# Altium project URC_eZ-FET_Lite.PrjPcb
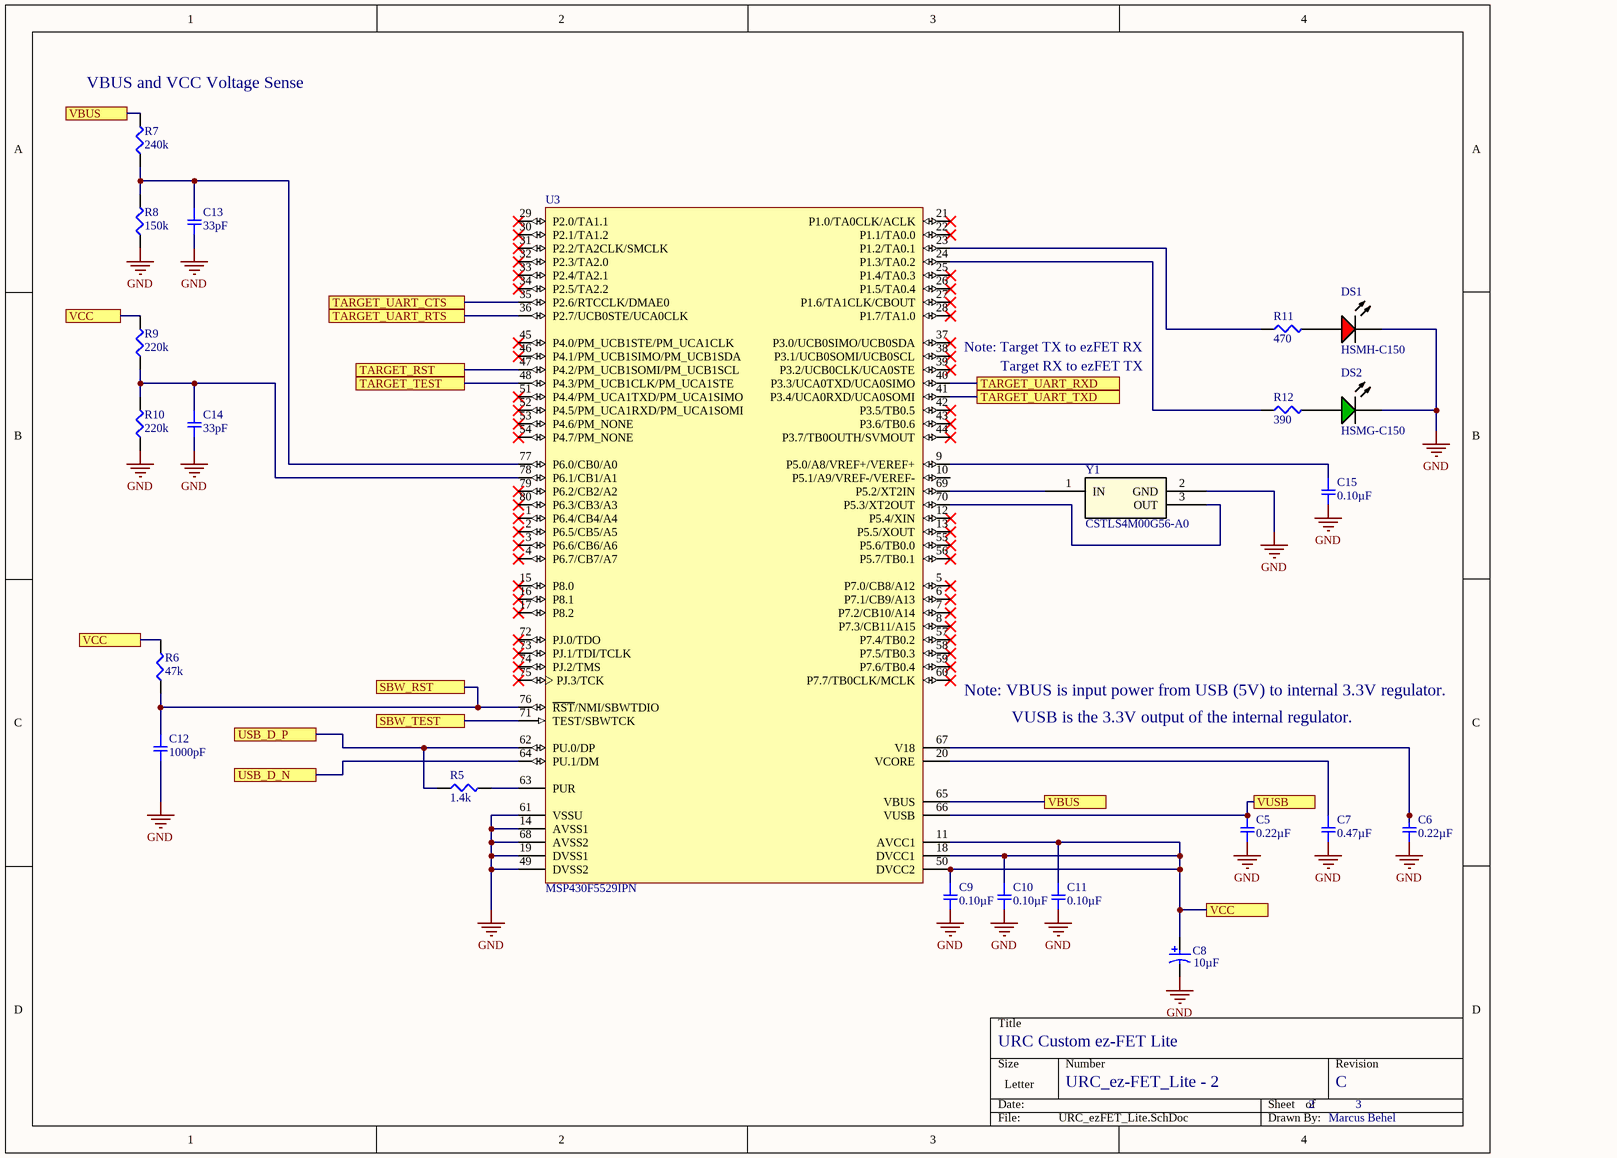
[diagram p0: URC_ezFET_Lite.SchDoc]
3 sheets, 36 parts. Net scope: global (net labels, ports and power ports of the same name join across sheets).
Board file: URC_ezFET_Lite.PcbDoc
Sheets:
  URC_ezFET_Lite.SchDoc
  URC_ezFET_Lite-USB.SchDoc
  URC_eZFET_Lite-Headers.SchDoc

## Sheet URC_ezFET_Lite.SchDoc: URC Custom ez-FET Lite
size Letter; DrawnBy: Marcus Behel; DocumentNumber: URC_ez-FET_Lite - 2; Revision: C; SheetNumber: 2; SheetTotal: 3

### Parts
C5  0.22µF  [SMD-1206C]
C6  0.22µF  [SMD-1206C]
C7  0.47µF  [SMD-1206C]
C8  Capacitance: 10µF  [KEMT-A-3216-18-2_M]  (hidden comment: T491A106K010AT)
C9  0.10µF  [SMD-1206C]
C10  0.10µF  [SMD-1206C]
C11  0.10µF  [SMD-1206C]
C12  1000pF  [SMD-1206C]
C13  33pF  [SMD-1206C]
C14  33pF  [SMD-1206C]
C15  0.10µF  [SMD-1206C]
DS1  HSMH-C150  [AVAG-HSMX-C150_V]
DS2  HSMG-C150  [AVAG-HSMX-C150_V]
R5  1.4k  [SMD-0805-RES]
R6  47k  [SMD-1206-RES]
R7  240k  [SMD-1206-RES]
R8  150k  [SMD-1206-RES]
R9  220k  [SMD-1206-RES]
R10  220k  [SMD-1206-RES]
R11  470  [SMD-1206-RES]
R12  390  [SMD-1206-RES]
U3  MSP430F5529IPN  [PN0080A_L]
Y1  CSTLS4M00G56-A0  [CSTLS_G]

### Ports
SBW_RST, SBW_TEST, TARGET_RST, TARGET_TEST, TARGET_UART_CTS, TARGET_UART_RTS, TARGET_UART_RXD, TARGET_UART_TXD, USB_D_N, USB_D_P, VBUS, VCC, VUSB

### Nets
GND: C5.2 C6.2 C7.2 C8.2 C9.2 C10.2 C11.2 C12.2 C13.2 C14.2 C15.2 DS1.2(K) DS2.2(K) R8.1 R10.1 U3.14(AVSS1) U3.19(DVSS1) U3.49(DVSS2) U3.61(VSSU) U3.68(AVSS2) Y1.2(GND)
SBW_RST: C12.1 R6.1 U3.76(~{RST}/NMI/SBWTDIO) ; port SBW_RST
SBW_TEST: U3.71(TEST/SBWTCK) ; port SBW_TEST
TARGET_RST: U3.47(P4.2/PM_UCB1SOMI/PM_UCB1SCL) ; port TARGET_RST
TARGET_TEST: U3.48(P4.3/PM_UCB1CLK/PM_UCA1STE) ; port TARGET_TEST
TARGET_UART_CTS: U3.35(P2.6/RTCCLK/DMAE0) ; port TARGET_UART_CTS
TARGET_UART_RTS: U3.36(P2.7/UCB0STE/UCA0CLK) ; port TARGET_UART_RTS
TARGET_UART_RXD: U3.40(P3.3/UCA0TXD/UCA0SIMO) ; port TARGET_UART_RXD
TARGET_UART_TXD: U3.41(P3.4/UCA0RXD/UCA0SOMI) ; port TARGET_UART_TXD
USB_D_N: U3.64(PU.1/DM) ; port USB_D_N
USB_D_P: R5.1 U3.62(PU.0/DP) ; port USB_D_P
VBUS: R7.2 U3.65(VBUS) ; port VBUS
VCC: C8.1 C9.1 C10.1 C11.1 R6.2 R9.2 U3.11(AVCC1) U3.18(DVCC1) U3.50(DVCC2) ; port VCC
VUSB: C5.1 U3.66(VUSB) ; port VUSB
NetC6_1: C6.1 U3.67(V18)
NetC7_1: C7.1 U3.20(VCORE)
NetC13_1: C13.1 R7.1 R8.2 U3.77(P6.0/CB0/A0)
NetC14_1: C14.1 R9.1 R10.2 U3.78(P6.1/CB1/A1)
NetC15_1: C15.1 U3.9(P5.0/A8/VREF+/VEREF+)
NetDS1_1: DS1.1(A) R11.2
NetDS2_1: DS2.1(A) R12.2
NetR5_2: R5.2 U3.63(PUR)
NetR11_1: R11.1 U3.23(P1.2/TA0.1)
NetR12_1: R12.1 U3.24(P1.3/TA0.2)
NetU3_69: U3.69(P5.2/XT2IN) Y1.1(IN)
NetU3_70: U3.70(P5.3/XT2OUT) Y1.3(OUT)

Not connected (* = marked no-connect by the designer): U3 1(P6.4/CB4/A4)* 2(P6.5/CB5/A5)* 3(P6.6/CB6/A6)* 4(P6.7/CB7/A7)* 5(P7.0/CB8/A12)* 6(P7.1/CB9/A13)* 7(P7.2/CB10/A14)* 8(P7.3/CB11/A15)* 10(P5.1/A9/VREF-/VEREF-) 12(P5.4/XIN)* 13(P5.5/XOUT)* 15(P8.0)* 16(P8.1)* 17(P8.2)* 21(P1.0/TA0CLK/ACLK)* 22(P1.1/TA0.0)* 25(P1.4/TA0.3)* 26(P1.5/TA0.4)* 27(P1.6/TA1CLK/CBOUT)* 28(P1.7/TA1.0)* 29(P2.0/TA1.1)* 30(P2.1/TA1.2)* 31(P2.2/TA2CLK/SMCLK)* 32(P2.3/TA2.0)* 33(P2.4/TA2.1)* 34(P2.5/TA2.2)* 37(P3.0/UCB0SIMO/UCB0SDA)* 38(P3.1/UCB0SOMI/UCB0SCL)* 39(P3.2/UCB0CLK/UCA0STE)* 42(P3.5/TB0.5)* 43(P3.6/TB0.6)* 44(P3.7/TB0OUTH/SVMOUT)* 45(P4.0/PM_UCB1STE/PM_UCA1CLK)* 46(P4.1/PM_UCB1SIMO/PM_UCB1SDA)* 51(P4.4/PM_UCA1TXD/PM_UCA1SIMO)* 52(P4.5/PM_UCA1RXD/PM_UCA1SOMI)* 53(P4.6/PM_NONE)* 54(P4.7/PM_NONE)* 55(P5.6/TB0.0)* 56(P5.7/TB0.1)* 57(P7.4/TB0.2)* 58(P7.5/TB0.3)* 59(P7.6/TB0.4)* 60(P7.7/TB0CLK/MCLK)* 72(PJ.0/TDO)* 73(PJ.1/TDI/TCLK)* 74(PJ.2/TMS)* 75(PJ.3/TCK)* 79(P6.2/CB2/A2)* 80(P6.3/CB3/A3)*

### Notes on the sheet
- (near R7) VBUS and VCC Voltage Sense
- (near U3) Note: Target TX to ezFET RX
- Target RX to ezFET TX
- (near U3) Note: VBUS is input power from USB (5V) to internal 3.3V regulator.
- VUSB is the 3.3V output of the internal regulator.

### Library data of the parts
C5 C6 = GCM31MR71H224KA37L: CAP CER 0.22UF 50V X7R 1206; Manufacturer: Murata Electronics North America; Factory Stock: 0; Unit Price (USD): 0.34; Minimum Quantity: 1; Tolerance: ±10%; Datasheets: http://www.murata.com/~/media/webrenewal/support/library/catalog/products/capacitor/mlcc/c03e.ashx; Image: //media.digikey.com/Renders/Murata%20Renders/GR331BD72E473KW01L.jpg; Digi-Key Part Number: 490-8059-1-ND; Part Number: GCM31MR71H224KA37L; Quantity Available: 6941; @ qty: 0; Packaging: Cut Tape (CT); Series: GCM; Part Status: Active; Value: 0.22µF; Voltage: 50V; Temperature Coefficient: X7R; Operating Temperature: -55°C ~ 125°C; Features: -; Ratings: AEC-Q200; Applications: Automotive; Mounting Type: Surface Mount, MLCC; Package / Case: 1206 (3216 Metric); Size / Dimension: 0.126" L x 0.063" W (3.20mm x 1.60mm); Height - Seated (Max): -; Thickness (Max): 0.049" (1.25mm); Lead Spacing: -; Lead Style: -
C7 = GCM31MR71H474KA37L: CAP CER 0.47UF 50V X7R 1206; Manufacturer: Murata Electronics North America; Factory Stock: 0; Unit Price (USD): 0.53; Minimum Quantity: 1; Tolerance: ±10%; Datasheets: http://www.murata.com/~/media/webrenewal/support/library/catalog/products/capacitor/mlcc/c03e.ashx; Image: //media.digikey.com/Renders/Murata%20Renders/GR331BD72E473KW01L.jpg; Digi-Key Part Number: 490-8061-1-ND; Part Number: GCM31MR71H474KA37L; Quantity Available: 11849; @ qty: 0; Packaging: Cut Tape (CT); Series: GCM; Part Status: Active; Value: 0.47µF; Voltage: 50V; Temperature Coefficient: X7R; Operating Temperature: -55°C ~ 125°C; Features: -; Ratings: AEC-Q200; Applications: Automotive; Mounting Type: Surface Mount, MLCC; Package / Case: 1206 (3216 Metric); Size / Dimension: 0.126" L x 0.063" W (3.20mm x 1.60mm); Height - Seated (Max): -; Thickness (Max): 0.049" (1.25mm); Lead Spacing: -; Lead Style: -
C8 = CMP-2000-05172-1: Capacitor, Tantalum, 10 uF, +/- 10%, 10 V, -55 to 125 degC, 2-Pin SMD (1206), RoHS, Tape and Reel; Manufacturer Size Code: A; Manufacturer: Kemet; Type: Molded; Online Catalog: T491Series; Other Names: 399-3684-2; Voltage - Rated: 10V; Lifetime @ Temp.: 2000Hrs@85degC; Product Training Modules: CapacitorBasics-TypicalUsesforCapacitorsDeratingGuidelinesforSurfaceMountTantalumCapacitors; ESR (Equivalent Series Resistance): 3.8Ohm; Catalog Drawings: T49x,T5xxSeries_A-side1T49x,T5xxSeries_A,B-side2T49x,T5xxSeries_A,SBottom; Family: TantalumCapacitors; Manufacturer URL: http://www.kemet.com/; Datasheet URL: http://www.farnell.com/datasheets/1824869.pdf; Package Reference: 1206; Packaging: Tape&Reel(TR); Series: T491; Operating Temperature: -55degC~125degC; Mounting Type: SurfaceMount; Height - Seated (Max): 0.071"(1.80mm); Package / Case: 1206(3216Metric); Package Description: 2-Pin Surface Mount Device, Body 3.2 x 1.6 mm; Features: GeneralPurpose; Tolerance: ±10%; Lead Spacing: -; Size / Dimension: 0.126"Lx0.063"W(3.20mmx1.60mm); Standard Package: 2,000; Datasheet Version: Apr-14; Category: Capacitors
C9-C11 = GCM319R71H104KA37D: CAP CER 0.1UF 50V X7R 1206; Manufacturer: Murata Electronics North America; Factory Stock: 0; Unit Price (USD): 0.21; Minimum Quantity: 1; Tolerance: ±10%; Datasheets: http://www.murata.com/~/media/webrenewal/support/library/catalog/products/capacitor/mlcc/c03e.ashx; Image: //media.digikey.com/Renders/Murata%20Renders/GR331BD72E473KW01L.jpg; Digi-Key Part Number: 490-11166-1-ND; Part Number: GCM319R71H104KA37D; Quantity Available: 5066; @ qty: 0; Packaging: Cut Tape (CT); Series: GCM; Part Status: Active; Value: 0.10µF; Voltage: 50V; Temperature Coefficient: X7R; Operating Temperature: -55°C ~ 125°C; Features: -; Ratings: AEC-Q200; Applications: Automotive; Mounting Type: Surface Mount, MLCC; Package / Case: 1206 (3216 Metric); Size / Dimension: 0.126" L x 0.063" W (3.20mm x 1.60mm); Height - Seated (Max): -; Thickness (Max): 0.037" (0.95mm); Lead Spacing: -; Lead Style: -
C12 = GRM319R71H102KA01D: CAP CER 1000PF 50V X7R 1206; Manufacturer: Murata Electronics North America; Factory Stock: 0; Unit Price (USD): 0.19; Minimum Quantity: 1; Tolerance: ±10%; Datasheets: http://www.murata.com/~/media/webrenewal/support/library/catalog/products/capacitor/mlcc/c02e.pdf; Image: //media.digikey.com/Renders/Murata%20Renders/GR331BD72E473KW01L.jpg; Digi-Key Part Number: 490-11610-1-ND; Part Number: GRM319R71H102KA01D; Quantity Available: 4837; @ qty: 0; Packaging: Cut Tape (CT); Series: GRM; Part Status: Active; Value: 1000pF; Voltage: 50V; Temperature Coefficient: X7R; Operating Temperature: -55°C ~ 125°C; Features: -; Ratings: -; Applications: General Purpose; Mounting Type: Surface Mount, MLCC; Package / Case: 1206 (3216 Metric); Size / Dimension: 0.126" L x 0.063" W (3.20mm x 1.60mm); Height - Seated (Max): -; Thickness (Max): 0.037" (0.95mm); Lead Spacing: -; Lead Style: -
C13 C14 = GCM31A7U2J330JX01D: CAP CER 33PF 630V U2J 1206; Manufacturer: Murata Electronics North America; Factory Stock: 0; Unit Price (USD): 0.52; Minimum Quantity: 1; Tolerance: ±5%; Datasheets: http://www.murata.com/~/media/webrenewal/support/library/catalog/products/capacitor/mlcc/c03e.ashx; Image: //media.digikey.com/Renders/Murata%20Renders/GR331BD72E473KW01L.jpg; Digi-Key Part Number: 490-5040-1-ND; Part Number: GCM31A7U2J330JX01D; Quantity Available: 10466; @ qty: 0; Packaging: Cut Tape (CT); Series: GCM; Part Status: Active; Value: 33pF; Voltage: 630V; Temperature Coefficient: U2J; Operating Temperature: -55°C ~ 125°C; Features: -; Ratings: AEC-Q200; Applications: Automotive; Mounting Type: Surface Mount, MLCC; Package / Case: 1206 (3216 Metric); Size / Dimension: 0.126" L x 0.063" W (3.20mm x 1.60mm); Height - Seated (Max): -; Thickness (Max): 0.039" (1.00mm); Lead Spacing: -; Lead Style: -
C15 = GCJ31CR72E104KXJ3L: CAP CER 0.1UF 250V X7R 1206; Manufacturer: Murata Electronics North America; Factory Stock: 0; Unit Price (USD): 0.36; Minimum Quantity: 1; Tolerance: ±10%; Datasheets: http://www.murata.com/~/media/webrenewal/support/library/catalog/products/capacitor/mlcc/c03e.ashx; Image: //media.digikey.com/Renders/Murata%20Renders/GR331BD72E473KW01L.jpg; Digi-Key Part Number: 490-12647-1-ND; Part Number: GCJ31CR72E104KXJ3L; Quantity Available: 3645; @ qty: 0; Packaging: Cut Tape (CT); Series: GCJ; Part Status: Active; Value: 0.10µF; Voltage: 250V; Temperature Coefficient: X7R; Operating Temperature: -55°C ~ 125°C; Features: Soft Termination; Ratings: AEC-Q200; Applications: Automotive, Boardflex Sensitive; Mounting Type: Surface Mount, MLCC; Package / Case: 1206 (3216 Metric); Size / Dimension: 0.126" L x 0.063" W (3.20mm x 1.60mm); Height - Seated (Max): -; Thickness (Max): 0.071" (1.80mm); Lead Spacing: -; Lead Style: -
DS1 = CMP-2000-06426-1: LED Uni-Color Red, 65 mW, 25 mA, -40 to 85 degC, 2-Pin SMD, RoHS, Tape and Reel; Manufacturer: Avago; Product Height (mm): 1.1mm; Power Dissipation: 78W; Product Length (mm): 3.2mm; Forward Voltage: 2.6V; Luminous Intensity: 17mcd; DELETED: Compliant; Shape Type: Rectangular; Peak Wavelength: 660nm; Main Category: ChipLED; Dominant Wave Length: 639nm; Rad Hardened: No; Lens Type: ColorlessDiffused; Product Depth (mm): 1.6mm; Reverse Voltage: 5V; Forward Current: 25mA; Chip Material: GaAlAs; Test Current (It): 20mA; Viewing Angle: 170deg; Number of  Elements: 1; Type: Uni-Color; Package Reference: HSMX-C150; Package Description: 2-Pin Surface Mount Device, Body 3.2 x 1.6 mm; Operating Temp Range: -40Cto85C; Mounting: SurfaceMount; Emitting Color: Red; Pin Count: 2; Operating Temperature Classification: Industrial; Datasheet URL: http://media.digikey.com/pdf/Data%20Sheets/Avago%20PDFs/HSMz-Czzz.pdf; Package Type: ChipLed; Mounting Technology: SurfaceMount; High Brightness: No; Lens Dimensions: 2x1.6x0.6mm; Manufacturer URL: http://www.avagotech.com/; Lum Intensity: 17mcd; Datasheet Version: 03/2012; Packaging: TapeandReel
DS2 = CMP-2000-05061-1: Chip LED, Green, 65 mW, 25 mA, -40 to 85 degC, 2-Pin SMD, RoHS, Tape and Reel; Manufacturer: Avago; Forward Voltage VF Max: 2.6V; Forward Current If Max: 20mA; Bulb Size: 1.6mmx2mm; PIV Max: 5V; Dominant Wavelength: 572nm; External Length / Height: 3.2mm; SVHC: NoSVHC(16-Jun-2014); Viewing Angle: 170deg; Peak Wavelength: 570nm; External Width: 1.6mm; No. of Pins: 2; Luminous Intensity Typ: 15mcd; Light Output Orientation: TopEmitting; LED Type: Standard; Luminous Intensity @ If Min: 4.5mcd; Voltage Vf Min: 2.2V; Lens Shape: Rectangular; External Depth: 1.1mm; Material: GaP; Opto Mounting Orientation: Top; Package Reference: HSMX-C150; Mounting Type: SMD; Datasheet Version: Mar-12; Storage Temperature Max: 85degC; Forward Current If: 20mA; Operating Temperature Min: -30degC; Operating Temperature Max: 85degC; Wavelength Typ: 572nm; Datasheet URL: https://datasheet.ciiva.com/11774/0900766b804a6539-11774272.pdf; Luminous Intensity: 15mcd; Manufacturer URL: http://www.avagotech.com/; Storage Temperature Min: -40degC; Package Description: 2-Pin Surface Mount Device, Body 3.2 x 1.6 mm; MSL: MSL2A-4weeks; LED Colour: Green; Operating Temperature Range: -30degCto+85degC; LED Mounting: SMD; Voltage Vf Typ: 2.2V; Opto Case Style: SMD; Packaging: CutTape; Forward Voltage: 2.2V; Reverse Protection Voltage: 5V
R5 = ERJ-6ENF1401V: RES SMD 1.4K OHM 1% 1/8W 0805; Manufacturer: Panasonic Electronic Components; Factory Stock: 0; Unit Price (USD): 0.00729; @ qty: 1500; Minimum Quantity: 1; Power (Watts): 0.125W, 1/8W; Temperature Coefficient: ±100ppm/°C; Part Number: ERJ-6ENF1401V; Datasheets: http://industrial.panasonic.com/www-cgi/jvcr13pz.cgi?E+PZ+3+AOA0002+ERJ6ENF1401V+7+WW; Image: //media.digikey.com/Renders/Panasonic%20Renders/ERJ-0805%20Pkg.jpg; Digi-Key Part Number: P1.40KCCT-ND; Quantity Available: 52856; Packaging: Cut Tape (CT); Series: ERJ; Part Status: Active; Value: 1.4k; Tolerance: ±1%; Composition: Thick Film; Features: Automotive AEC-Q200; Operating Temperature: -55°C ~ 155°C; Package / Case: 0805 (2012 Metric); Supplier Device Package: 0805; Size / Dimension: 0.079" L x 0.049" W (2.00mm x 1.25mm); Height - Seated (Max): 0.028" (0.70mm); Number of Terminations: 2; Failure Rate: -
R6 = ERJ-P08J473V: RES SMD 47K OHM 5% 2/3W 1206; Manufacturer: Panasonic Electronic Components; Factory Stock: 0; Unit Price (USD): 0.02178; @ qty: 1500; Minimum Quantity: 1; Power (Watts): 0.667W, 2/3W; Temperature Coefficient: ±200ppm/°C; Part Number: ERJ-P08J473V; Datasheets: https://industrial.panasonic.com/cdbs/www-data/pdf/RDA0000/AOA0000C243.pdf; Image: //media.digikey.com/Renders/Panasonic%20Renders/ERJ-1206%20Pkg.jpg; Digi-Key Part Number: P47KALCT-ND; Quantity Available: 29484; Packaging: Cut Tape (CT); Series: ERJ; Part Status: Active; Value: 47k; Tolerance: ±5%; Composition: Thick Film; Features: Automotive AEC-Q200, Pulse Withstanding; Operating Temperature: -55°C ~ 155°C; Package / Case: 1206 (3216 Metric); Supplier Device Package: 1206; Size / Dimension: 0.126" L x 0.063" W (3.20mm x 1.60mm); Height - Seated (Max): 0.028" (0.70mm); Number of Terminations: 2; Failure Rate: -
R7 = ERJ-P08J244V: RES SMD 240K OHM 5% 2/3W 1206; Manufacturer: Panasonic Electronic Components; Factory Stock: 0; Unit Price (USD): 0.02178; @ qty: 1500; Minimum Quantity: 1; Power (Watts): 0.667W, 2/3W; Temperature Coefficient: ±200ppm/°C; Part Number: ERJ-P08J244V; Datasheets: https://industrial.panasonic.com/cdbs/www-data/pdf/RDA0000/AOA0000C243.pdf; Image: //media.digikey.com/Renders/Panasonic%20Renders/ERJ-1206%20Pkg.jpg; Digi-Key Part Number: P240KALCT-ND; Quantity Available: 21188; Packaging: Cut Tape (CT); Series: ERJ; Part Status: Active; Value: 240k; Tolerance: ±5%; Composition: Thick Film; Features: Automotive AEC-Q200, Pulse Withstanding; Operating Temperature: -55°C ~ 155°C; Package / Case: 1206 (3216 Metric); Supplier Device Package: 1206; Size / Dimension: 0.126" L x 0.063" W (3.20mm x 1.60mm); Height - Seated (Max): 0.028" (0.70mm); Number of Terminations: 2; Failure Rate: -
R8 = ERJ-P08J154V: RES SMD 150K OHM 5% 2/3W 1206; Manufacturer: Panasonic Electronic Components; Factory Stock: 0; Unit Price (USD): 0.02178; @ qty: 1500; Minimum Quantity: 1; Power (Watts): 0.667W, 2/3W; Temperature Coefficient: ±200ppm/°C; Part Number: ERJ-P08J154V; Datasheets: https://industrial.panasonic.com/cdbs/www-data/pdf/RDA0000/AOA0000C243.pdf; Image: //media.digikey.com/Renders/Panasonic%20Renders/ERJ-1206%20Pkg.jpg; Digi-Key Part Number: P150KALCT-ND; Quantity Available: 30000; Packaging: Cut Tape (CT); Series: ERJ; Part Status: Active; Value: 150k; Tolerance: ±5%; Composition: Thick Film; Features: Automotive AEC-Q200, Pulse Withstanding; Operating Temperature: -55°C ~ 155°C; Package / Case: 1206 (3216 Metric); Supplier Device Package: 1206; Size / Dimension: 0.126" L x 0.063" W (3.20mm x 1.60mm); Height - Seated (Max): 0.028" (0.70mm); Number of Terminations: 2; Failure Rate: -
R9 R10 = ERJ-P08J224V: RES SMD 220K OHM 5% 2/3W 1206; Manufacturer: Panasonic Electronic Components; Factory Stock: 0; Unit Price (USD): 0.02178; @ qty: 1500; Minimum Quantity: 1; Power (Watts): 0.667W, 2/3W; Temperature Coefficient: ±200ppm/°C; Part Number: ERJ-P08J224V; Datasheets: https://industrial.panasonic.com/cdbs/www-data/pdf/RDA0000/AOA0000C243.pdf; Image: //media.digikey.com/Renders/Panasonic%20Renders/ERJ-1206%20Pkg.jpg; Digi-Key Part Number: P220KALCT-ND; Quantity Available: 11189; Packaging: Cut Tape (CT); Series: ERJ; Part Status: Active; Value: 220k; Tolerance: ±5%; Composition: Thick Film; Features: Automotive AEC-Q200, Pulse Withstanding; Operating Temperature: -55°C ~ 155°C; Package / Case: 1206 (3216 Metric); Supplier Device Package: 1206; Size / Dimension: 0.126" L x 0.063" W (3.20mm x 1.60mm); Height - Seated (Max): 0.028" (0.70mm); Number of Terminations: 2; Failure Rate: -
R11 = ERJ-8ENF4700V: RES SMD 470 OHM 1% 1/4W 1206; Manufacturer: Panasonic Electronic Components; Factory Stock: 0; Unit Price (USD): 0.00933; @ qty: 1500; Minimum Quantity: 1; Power (Watts): 0.25W, 1/4W; Temperature Coefficient: ±100ppm/°C; Part Number: ERJ-8ENF4700V; Datasheets: http://industrial.panasonic.com/www-cgi/jvcr13pz.cgi?E+PZ+3+AOA0002+ERJ8ENF4700V+7+WW; Image: //media.digikey.com/Renders/Panasonic%20Renders/ERJ-1206%20Pkg.jpg; Digi-Key Part Number: P470FCT-ND; Quantity Available: 55045; Packaging: Cut Tape (CT); Series: ERJ; Part Status: Active; Value: 470; Tolerance: ±1%; Composition: Thick Film; Features: Automotive AEC-Q200; Operating Temperature: -55°C ~ 155°C; Package / Case: 1206 (3216 Metric); Supplier Device Package: 1206; Size / Dimension: 0.126" L x 0.063" W (3.20mm x 1.60mm); Height - Seated (Max): 0.028" (0.70mm); Number of Terminations: 2; Failure Rate: -
R12 = ERJ-8ENF3900V: RES SMD 390 OHM 1% 1/4W 1206; Manufacturer: Panasonic Electronic Components; Factory Stock: 0; Unit Price (USD): 0.00933; @ qty: 1500; Minimum Quantity: 1; Power (Watts): 0.25W, 1/4W; Temperature Coefficient: ±100ppm/°C; Part Number: ERJ-8ENF3900V; Datasheets: http://industrial.panasonic.com/www-cgi/jvcr13pz.cgi?E+PZ+3+AOA0002+ERJ8ENF3900V+7+WW; Image: //media.digikey.com/Renders/Panasonic%20Renders/ERJ-1206%20Pkg.jpg; Digi-Key Part Number: P390FCT-ND; Quantity Available: 65574; Packaging: Cut Tape (CT); Series: ERJ; Part Status: Active; Value: 390; Tolerance: ±1%; Composition: Thick Film; Features: Automotive AEC-Q200; Operating Temperature: -55°C ~ 155°C; Package / Case: 1206 (3216 Metric); Supplier Device Package: 1206; Size / Dimension: 0.126" L x 0.063" W (3.20mm x 1.60mm); Height - Seated (Max): 0.028" (0.70mm); Number of Terminations: 2; Failure Rate: -
U3 = CMP-0365-00412-2: 25 MHz Mixed Signal Microcontroller with 128 KB Flash, 8192 B SRAM and 63 GPIOs, -40 to 85 degC, 80-pin QFP (PN), Green (RoHS & no Sb/Br); Manufacturer: Texas Instruments; USCI_B (I2C & SPI): 2; Comparators: Yes; SubFamily: 5 Series; Flash(KB): 128; ADC: 12-bit SAR; DMA: 3; SRAM(B): 8192; ADC Channels: 16; GPIO: 63; Timers - 16-bit: 4; Multiplier: 32x32; USB: 1; Frequency(MHz): 25; PackageDescription: 80-Pin Plastic Quad Flat Pack, Body 12 x 12 mm, Pitch 0.5 mm; ComponentLink3Description: Package Specification; PackageReference: PN0080A; Brown Out Reset: Yes; Mounting Technology: Surface Mount; ComponentLink3URL: http://www.ti.com/lit/ml/mtqf010a/mtqf010a.pdf; ComponentLink2Description: Datasheet; Real-Time Clock: Yes; ComponentLink1Description: Manufacturer URL; PartNumber: MSP430F5529IPN; Temp Sensor: Yes; USCI_A (UART/LIN/IrDA/SPI): 2; Code_JEDEC: MS-018; Watchdog: Yes; Eco-Plan: Green (RoHS & no Sb/Br); ComponentLink2URL: http://www.ti.com/general/docs/lit/getliterature.tsp?genericPartNumber=MSP430F5529&fileType=pdf; SVS: Yes; ComponentLink1URL: http://www.ti.com/; DatasheetVersion: SLAS590I
Y1 = CSTLS4M00G56-A0: No Description Available; Vendor: Murata; Built_By: EMA_UL_Team; Manufacturer_Part_Number: CSTLS4M00G56-A0; Copyright: Copyright (C) 2018 Accelerated Designs. All rights reserved; RefDes: RefDes; Type: DEV; Value: Value

## Sheet URC_ezFET_Lite-USB.SchDoc: URC Custom ez-FET Lite USB and Power
size Letter; DrawnBy: Marcus Behel; DocumentNumber: URC_ez-FET_Lite - 1; Revision: A; SheetNumber: 1; SheetTotal: 3
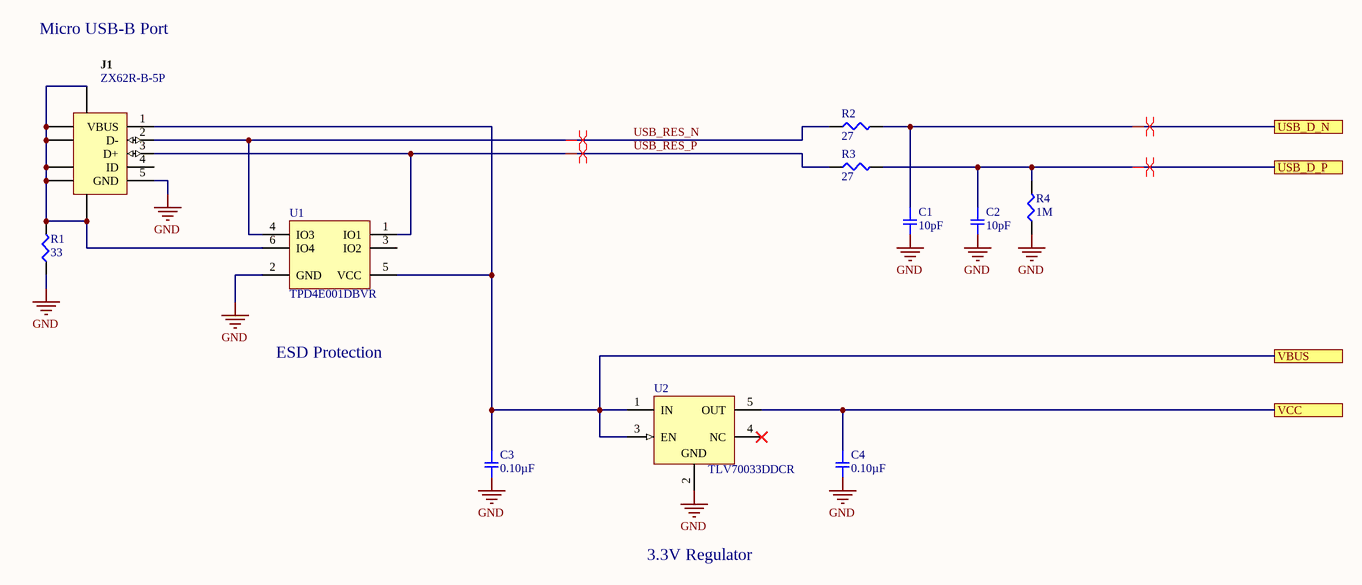
[diagram p1: URC_ezFET_Lite-USB.SchDoc]

### Parts
C1  10pF  [SMD-1206C]
C2  10pF  [SMD-1206C]
C3  0.10µF  [SMD-1206C]
C4  0.10µF  [SMD-1206C]
J1  ZX62R-B-5P  [HIRO-ZX62R-B-5P_V]
R1  33  [SMD-0805-RES]
R2  27  [SMD-0805-RES]
R3  27  [SMD-0805-RES]
R4  1M  [SMD-0805-RES]
U1  TPD4E001DBVR  [DBV0006A_M]
U2  TLV70033DDCR  [DDC0005A_M]

### Ports
USB_D_N, USB_D_P, VBUS, VCC

### Nets
GND: C1.2 C2.2 C3.2 C4.2 J1.5(GND) R1.1 R4.1 U1.2(GND) U2.2(GND)
USB_D_N: C1.1 R2.2 ; port USB_D_N
USB_D_P: C2.1 R3.2 R4.2 ; port USB_D_P
USB_RES_N: J1.2(D-) R2.1 U1.4(IO3)
USB_RES_P: J1.3(D+) R3.1 U1.1(IO1)
VBUS: C3.1 J1.1(VBUS) U1.5(VCC) U2.1(IN) U2.3(EN) ; port VBUS
VCC: C4.1 U2.5(OUT) ; port VCC
NetJ1_6: J1.6(SHLD) J1.7(SHLD) J1.8(SHLD) J1.9(SHLD) J1.10(SHLD) J1.11(SHLD) R1.2 U1.6(IO4)

Not connected (* = marked no-connect by the designer): J1 4(ID); U1 3(IO2); U2 4(NC)*

### Layout directives
differential pair: USB_D_N, USB_D_P, USB_RES_N, USB_RES_P

### Notes on the sheet
- Micro USB-B Port
- ESD Protection
- 3.3V Regulator

### Library data of the parts
C1 C2 = GCM31A7U2J100JX01D: CAP CER 10PF 630V U2J 1206; Manufacturer: Murata Electronics North America; Factory Stock: 0; Unit Price (USD): 0.52; Minimum Quantity: 1; Tolerance: ±5%; Datasheets: http://www.murata.com/~/media/webrenewal/support/library/catalog/products/capacitor/mlcc/c03e.ashx; Image: //media.digikey.com/Renders/Murata%20Renders/GR331BD72E473KW01L.jpg; Digi-Key Part Number: 490-5037-1-ND; Part Number: GCM31A7U2J100JX01D; Quantity Available: 4301; @ qty: 0; Packaging: Cut Tape (CT); Series: GCM; Part Status: Active; Value: 10pF; Voltage: 630V; Temperature Coefficient: U2J; Operating Temperature: -55°C ~ 125°C; Features: -; Ratings: AEC-Q200; Applications: Automotive; Mounting Type: Surface Mount, MLCC; Package / Case: 1206 (3216 Metric); Size / Dimension: 0.126" L x 0.063" W (3.20mm x 1.60mm); Height - Seated (Max): -; Thickness (Max): 0.039" (1.00mm); Lead Spacing: -; Lead Style: -
C3 C4 = GCM319R71H104KA37D: as C9 on sheet URC_ezFET_Lite; Datasheets: http://www.murata.com/~/media/webrenewal/support/library/catalog/products/capacitor/mlcc/c03e.ashx; Image: //media.digikey.com/Renders/Murata%20Renders/GR331BD72E473KW01L.jpg; Digi-Key Part Number: 490-11166-1-ND; Part Number: GCM319R71H104KA37D; Quantity Available: 5066; @ qty: 0; Packaging: Cut Tape (CT); Series: GCM; Part Status: Active; Value: 0.10µF; Voltage: 50V; Temperature Coefficient: X7R; Operating Temperature: -55°C ~ 125°C; Features: -; Ratings: AEC-Q200; Applications: Automotive; Mounting Type: Surface Mount, MLCC; Package / Case: 1206 (3216 Metric); Size / Dimension: 0.126" L x 0.063" W (3.20mm x 1.60mm); Height - Seated (Max): -; Thickness (Max): 0.037" (0.95mm); Lead Spacing: -; Lead Style: -
J1 = CMP-0031-00001-1: Connector; USBMicro-B,Reverse type, SMT; 5 Position; Right Angle; DatasheetVersion: 08/2010; Operating Temperature: -30 to 85 degC; Mounting Technology: Surface Mount; PartNumber: ZX62R-B-5P; PackageReference: ZX62R-B-5P; ComponentLink2URL: http://www.hirose.co.jp/cataloge_hp/e24200011.pdf; ComponentLink1URL: http://www.hirose.com/â€Ž; ComponentLink2Description: Datasheet; PackageDescription: 5-Pin USB Micro-B R/A Connector; ComponentLink1Description: Manufacturer URL
R1 = ERJ-6ENF33R0V: RES SMD 33 OHM 1% 1/8W 0805; Manufacturer: Panasonic Electronic Components; Factory Stock: 0; Unit Price (USD): 0.00729; @ qty: 1500; Minimum Quantity: 1; Power (Watts): 0.125W, 1/8W; Temperature Coefficient: ±100ppm/°C; Part Number: ERJ-6ENF33R0V; Datasheets: http://industrial.panasonic.com/www-cgi/jvcr13pz.cgi?E+PZ+3+AOA0002+ERJ6ENF33R0V+7+WW; Image: //media.digikey.com/Renders/Panasonic%20Renders/ERJ-0805%20Pkg.jpg; Digi-Key Part Number: P33.0CCT-ND; Quantity Available: 96423; Packaging: Cut Tape (CT); Series: ERJ; Part Status: Active; Value: 33; Tolerance: ±1%; Composition: Thick Film; Features: Automotive AEC-Q200; Operating Temperature: -55°C ~ 155°C; Package / Case: 0805 (2012 Metric); Supplier Device Package: 0805; Size / Dimension: 0.079" L x 0.049" W (2.00mm x 1.25mm); Height - Seated (Max): 0.028" (0.70mm); Number of Terminations: 2; Failure Rate: -
R2 R3 = ERJ-P06J270V: RES SMD 27 OHM 5% 1/2W 0805; Manufacturer: Panasonic Electronic Components; Factory Stock: 0; Unit Price (USD): 0.01839; @ qty: 1500; Minimum Quantity: 1; Power (Watts): 0.5W, 1/2W; Temperature Coefficient: ±300ppm/°C; Part Number: ERJ-P06J270V; Datasheets: https://industrial.panasonic.com/cdbs/www-data/pdf/RDA0000/AOA0000C243.pdf; Image: //media.digikey.com/Renders/Panasonic%20Renders/ERJ-0805%20Pkg.jpg; Digi-Key Part Number: P27ADCT-ND; Quantity Available: 18271; Packaging: Cut Tape (CT); Series: ERJ; Part Status: Active; Value: 27; Tolerance: ±5%; Composition: Thick Film; Features: Automotive AEC-Q200, Pulse Withstanding; Operating Temperature: -55°C ~ 155°C; Package / Case: 0805 (2012 Metric); Supplier Device Package: 0805; Size / Dimension: 0.079" L x 0.049" W (2.00mm x 1.25mm); Height - Seated (Max): 0.028" (0.70mm); Number of Terminations: 2; Failure Rate: -
R4 = ERJ-P06J105V: RES SMD 1M OHM 5% 1/2W 0805; Manufacturer: Panasonic Electronic Components; Factory Stock: 0; Unit Price (USD): 0.01839; @ qty: 1500; Minimum Quantity: 1; Power (Watts): 0.5W, 1/2W; Temperature Coefficient: ±200ppm/°C; Part Number: ERJ-P06J105V; Datasheets: https://industrial.panasonic.com/cdbs/www-data/pdf/RDA0000/AOA0000C243.pdf; Image: //media.digikey.com/Renders/Panasonic%20Renders/ERJ-0805%20Pkg.jpg; Digi-Key Part Number: P1.0MADCT-ND; Quantity Available: 36684; Packaging: Cut Tape (CT); Series: ERJ; Part Status: Active; Value: 1M; Tolerance: ±5%; Composition: Thick Film; Features: Automotive AEC-Q200, Pulse Withstanding; Operating Temperature: -55°C ~ 155°C; Package / Case: 0805 (2012 Metric); Supplier Device Package: 0805; Size / Dimension: 0.079" L x 0.049" W (2.00mm x 1.25mm); Height - Seated (Max): 0.028" (0.70mm); Number of Terminations: 2; Failure Rate: -
U1 = CMP-0326-00058-3: Low-Capacitance + / - 15-kV ESD Protection Array for High-Speed Data Interfaces, 4 Channels, -40 to +85 degC, 6-pin SOT-23 (DBV), Green (RoHS & no Sb/Br); Manufacturer: Texas Instruments; IEC 61000-4-2 Air-Gap(+/- kV): 15; 1394 / Firewire: TRUE; Breakdown Voltage(Min)(V): 11; IEC 61000-4-2 Contact(+/- kV): 8; IO Capacitance(Typ)(pF): 1.5; SubFamily: ESD Solution; ComponentLink3Description: URL Link1; PackageDescription: 6-Pin Plastic Small-Outline Package, 2.9 x 1.6 mm Body, 0.95 mm Pitch, 2.8 mm Lead Span; PackageVersion: revK, Mar-2006; Eco-Plan: Green (RoHS & no Sb/Br); USB High Speed: TRUE; ComponentLink2Description: Datasheet; ComponentLink1Description: Manufacturer URL; ComponentLink2URL: http://www.ti.com/general/docs/lit/getliterature.tsp?genericPartNumber=TPD4E001&fileType=pdf; PackageReference: DBV0006A; ComponentLink3URL: SamplesURL:http://www.ti.com/product/tpd4e001#samples; Serial ATA / eSATA: TRUE; ComponentLink1URL: http://www.ti.com/; Mounting Technology: Surface Mount; DatasheetVersion: SLLS682G; PartNumber: TPD4E001DBVR; IO Leakage Current(nA): 1.5
U2 = CMP-0394-01056-2: Single Output LDO, 200 mA, Fixed 3.3 V Output, 2 to 5.5 V Input, with Low IQ, 5-pin SOT (DDC), -40 to 125 degC, Green (RoHS & no Sb/Br); Manufacturer: Texas Instruments; Vin(Min)(V): 2; Vout Adj(Max)(V): 3.3; Iq(Typ)(mA): 0.03; SubFamily: Single Channel LDO; Iout(Max)(A): 0.2; Vdo(Typ)(mV): 175; Vin(Max)(V): 5.5; DatasheetVersion: SLVSA00D; Mounting Technology: Surface Mount; Accuracy(%): 2; ComponentLink1URL: http://www.ti.com/; ComponentLink2URL: http://www.ti.com/general/docs/lit/getliterature.tsp?genericPartNumber=TLV70033&fileType=pdf; ComponentLink3URL: http://www.ti.com/litv/pdf/mpds123d; PackageDescription: 5-Pin Plastic Small Outline, Body 2.9 x 1.6 mm, 0.95 mm Pitch; Vout Adj(Min)(V): 3.3; PackageVersion: 4204403-2/E; PartNumber: TLV70033DDCR; ComponentLink1Description: Manufacturer URL; PackageReference: DDC0005A; Code_JEDEC: MO-193; Fixed Output Options(V): 3.3; Eco-Plan: Green (RoHS & no Sb/Br); ComponentLink2Description: Datasheet; ComponentLink3Description: Package Specification

## Sheet URC_eZFET_Lite-Headers.SchDoc: URC Custom ez-FET Lite Headers
size Letter; DrawnBy: Marcus Behel; DocumentNumber: URC_ez-FET_Lite - 3; Revision: C; SheetNumber: 3; SheetTotal: 3
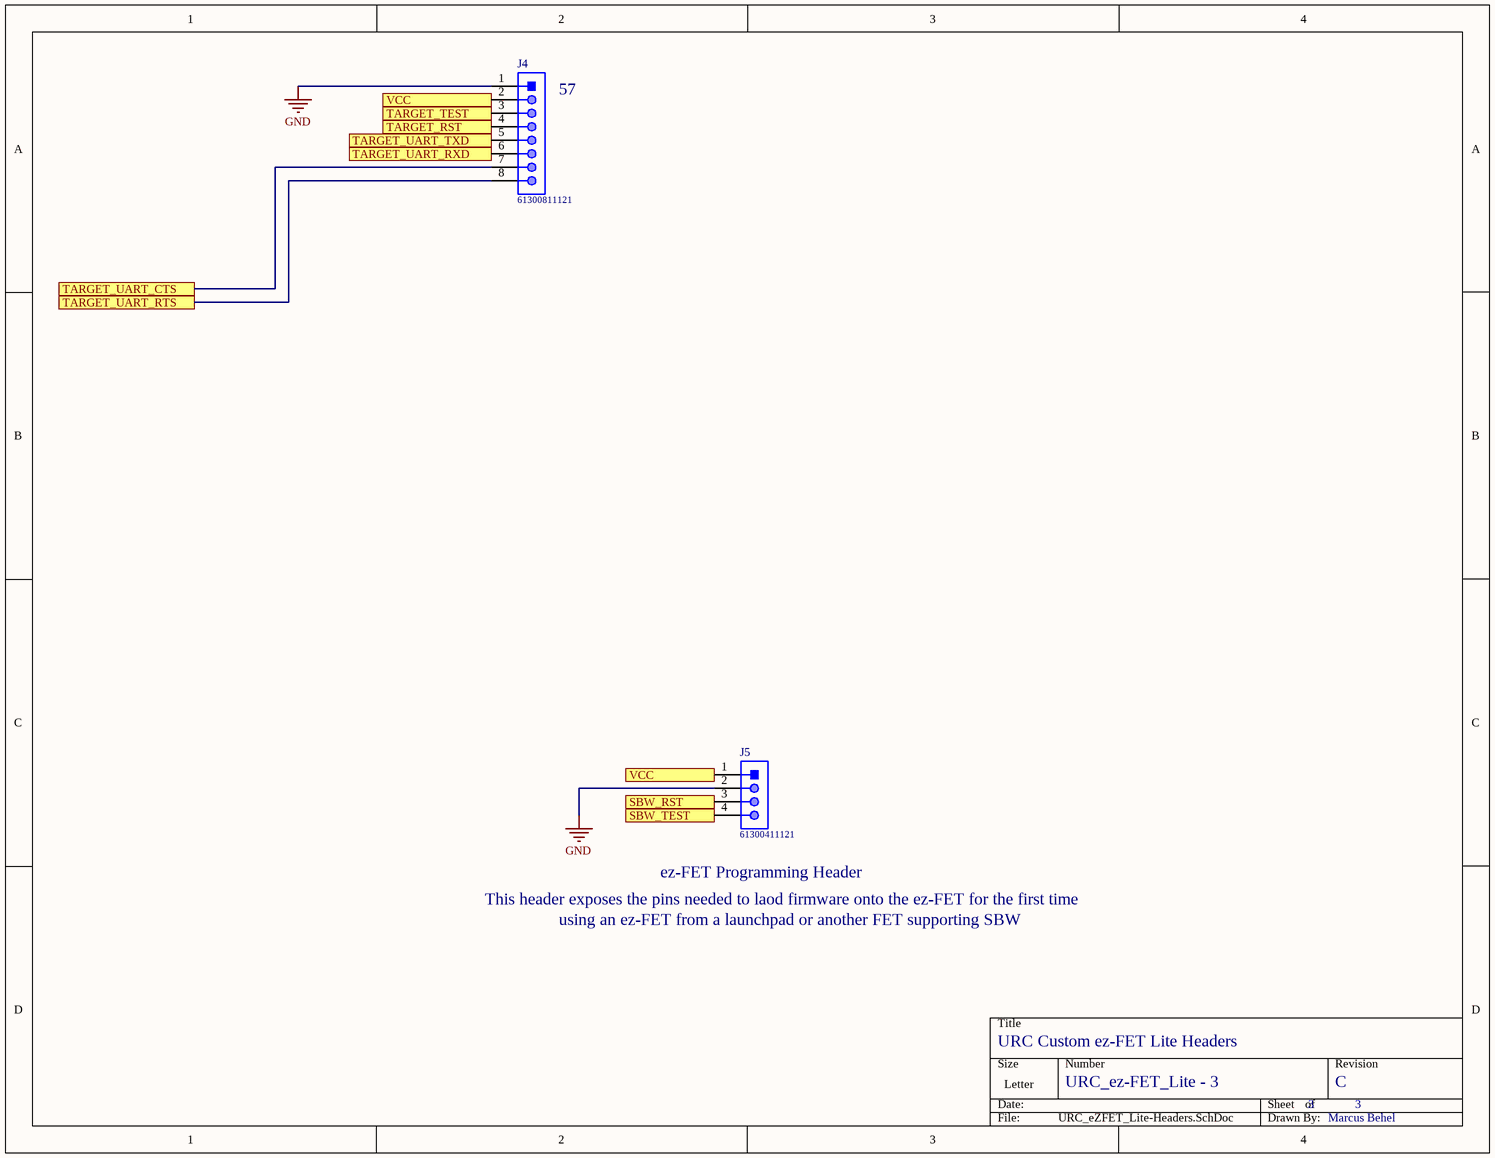
[diagram p2: URC_eZFET_Lite-Headers.SchDoc]

### Parts
J4  61300811121  [61300811121]
J5  61300411121  [61300411121]

### Ports
SBW_RST, SBW_TEST, TARGET_RST, TARGET_TEST, TARGET_UART_CTS, TARGET_UART_RTS, TARGET_UART_RXD, TARGET_UART_TXD, VCC

### Nets
GND: J4.1 J5.2
SBW_RST: J5.3 ; port SBW_RST
SBW_TEST: J5.4 ; port SBW_TEST
TARGET_RST: J4.4 ; port TARGET_RST
TARGET_TEST: J4.3 ; port TARGET_TEST
TARGET_UART_CTS: J4.7 ; port TARGET_UART_CTS
TARGET_UART_RTS: J4.8 ; port TARGET_UART_RTS
TARGET_UART_RXD: J4.6 ; port TARGET_UART_RXD
TARGET_UART_TXD: J4.5 ; port TARGET_UART_TXD
VCC: J4.2 J5.1 ; port VCC

### Notes on the sheet
- (near J4) 57
- This header exposes the pins needed to laod firmware onto the ez-FET for the first time
- (near J5) ez-FET Programming Header
- using an ez-FET from a launchpad or another FET supporting SBW

### Library data of the parts
J4 = CMP-1502-01076-1: THT Vertical Pin Header WR-PHD, Pitch 2.54 mm, Single Row, 8 pins; Manufacturer: Wurth Elektronik; Rated Current: 3A; Pin Number: 8; Working Voltage: 250VAC; Gender: Male; Contact Resistance: 20mOhm; Pitch: 2.54mm; Withstanding Voltage: 500VAC; Publisher: WurthElektronik; Operating Temperature: -40to105degC; Orientation: Vertical; Row Number: Single; Part Number: 61300811121; Package Reference: 61300811121; Mounting Technology: THT; Packaging: Bag; Manufacturer URL: http://www.we-online.de; Datasheet URL: https://katalog.we-online.de/em/datasheet/6130xx11121.pdf
J5 = CMP-1502-01064-1: THT Vertical Pin Header WR-PHD, Pitch 2.54 mm, Single Row, 4 pins; Manufacturer: Wurth Elektronik; Withstanding Voltage: 500VAC; Rated Current: 3A; Working Voltage: 250VAC; Pin Number: 4; Gender: Male; Contact Resistance: 20mOhm; Pitch: 2.54mm; Manufacturer URL: http://www.we-online.de; Operating Temperature: -40to105degC; Packaging: Bag; Mounting Technology: THT; Package Reference: 61300411121; Datasheet URL: https://katalog.we-online.de/em/datasheet/6130xx11121.pdf; Publisher: WurthElektronik; Part Number: 61300411121; Row Number: Single; Orientation: Vertical

## Nets that join several sheets
GND: URC_ezFET_Lite (21 pins), URC_ezFET_Lite-USB (9 pins), URC_eZFET_Lite-Headers (J4.1 J5.2)
SBW_RST: URC_ezFET_Lite (C12.1 R6.1 U3.76), URC_eZFET_Lite-Headers (J5.3)
SBW_TEST: URC_ezFET_Lite (U3.71), URC_eZFET_Lite-Headers (J5.4)
TARGET_RST: URC_ezFET_Lite (U3.47), URC_eZFET_Lite-Headers (J4.4)
TARGET_TEST: URC_ezFET_Lite (U3.48), URC_eZFET_Lite-Headers (J4.3)
TARGET_UART_CTS: URC_ezFET_Lite (U3.35), URC_eZFET_Lite-Headers (J4.7)
TARGET_UART_RTS: URC_ezFET_Lite (U3.36), URC_eZFET_Lite-Headers (J4.8)
TARGET_UART_RXD: URC_ezFET_Lite (U3.40), URC_eZFET_Lite-Headers (J4.6)
TARGET_UART_TXD: URC_ezFET_Lite (U3.41), URC_eZFET_Lite-Headers (J4.5)
USB_D_N: URC_ezFET_Lite (U3.64), URC_ezFET_Lite-USB (C1.1 R2.2)
USB_D_P: URC_ezFET_Lite (R5.1 U3.62), URC_ezFET_Lite-USB (C2.1 R3.2 R4.2)
VBUS: URC_ezFET_Lite (R7.2 U3.65), URC_ezFET_Lite-USB (5 pins)
VCC: URC_ezFET_Lite (9 pins), URC_ezFET_Lite-USB (C4.1 U2.5), URC_eZFET_Lite-Headers (J4.2 J5.1)